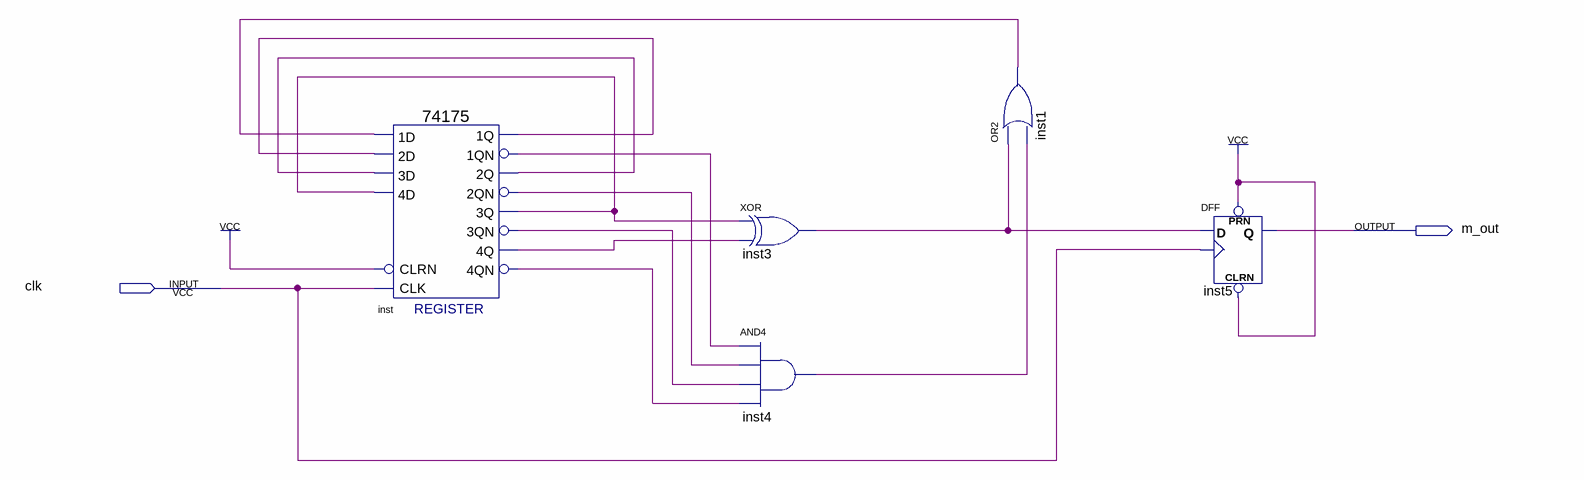
[diagram p0: schematic sheet]
// Quartus schematic m_gen.bdf as structural Verilog: 5 symbols, 2 pins
module m_gen (
  input  clk,
  output m_out
);

  wire inst1_out, inst3_out, inst4_out, inst_1q, inst_1qn, inst_2q, inst_2qn, inst_3q, inst_3qn, inst_4q,
       inst_4qn;

  \74175  inst (
    .CLRN(1'b1), .CLK(clk), .\3D (inst_2q), .\2D (inst_1q), .\1D (inst1_out), .\4D (inst_3q),
    .\1QN (inst_1qn), .\1Q (inst_1q), .\2QN (inst_2qn), .\3Q (inst_3q), .\2Q (inst_2q), .\4QN (inst_4qn),
    .\4Q (inst_4q), .\3QN (inst_3qn));
  xor inst3 (inst3_out, inst_3q, inst_4q);
  and inst4 (inst4_out, inst_1qn, inst_2qn, inst_3qn, inst_4qn);
  or inst1 (inst1_out, inst3_out, inst4_out);
  DFF inst5 (.CLRN(1'b1), .CLK(clk), .D(inst3_out), .PRN(1'b1), .Q(m_out));
endmodule
